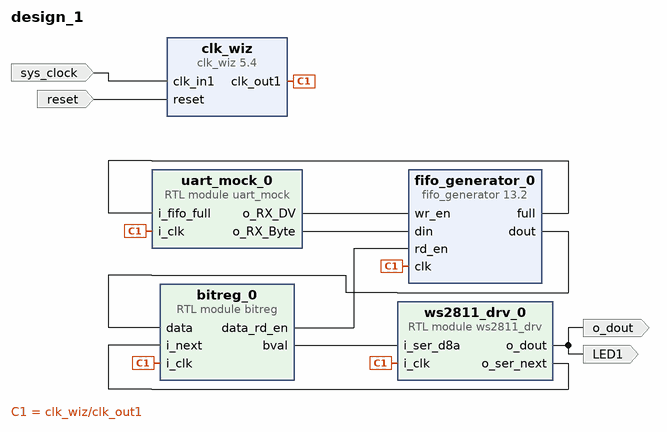
[diagram p0: block diagram of the top level]
# Vivado block design design_1, xc7a35tcpg236-1, Vivado 2017.4
create_bd_design design_1

create_bd_port -dir I -type clk sys_clock
set_property -dict {CONFIG.FREQ_HZ 12000000 CONFIG.PHASE 0.000} [get_bd_ports sys_clock]
create_bd_port -dir O -type data o_dout
create_bd_port -dir O -type data LED1
create_bd_port -dir I -type rst reset
set_property -dict {CONFIG.POLARITY ACTIVE_HIGH} [get_bd_ports reset]

create_bd_cell -type ip -vlnv xilinx.com:ip:clk_wiz:5.4 clk_wiz
set_property -dict [list \
  CONFIG.ENABLE_CLOCK_MONITOR false \
  CONFIG.PRIMITIVE MMCM \
  CONFIG.USE_MIN_POWER true \
  CONFIG.JITTER_SEL No_Jitter \
  CONFIG.CLKOUT1_DRIVES BUFGCE \
  CONFIG.CLKOUT2_DRIVES BUFGCE \
  CONFIG.CLKOUT3_DRIVES BUFGCE \
  CONFIG.CLKOUT4_DRIVES BUFGCE \
  CONFIG.CLKOUT5_DRIVES BUFGCE \
  CONFIG.CLKOUT6_DRIVES BUFGCE \
  CONFIG.CLKOUT7_DRIVES BUFGCE \
  CONFIG.FEEDBACK_SOURCE FDBK_AUTO \
  CONFIG.USE_LOCKED true \
  CONFIG.USE_INCLK_STOPPED false \
  CONFIG.USE_CLKFB_STOPPED false \
  CONFIG.OVERRIDE_MMCM false \
  CONFIG.MMCM_DIVCLK_DIVIDE 1 \
  CONFIG.MMCM_CLKFBOUT_MULT_F 53.125 \
  CONFIG.MMCM_COMPENSATION ZHOLD \
  CONFIG.MMCM_CLKOUT0_DIVIDE_F 6.375 \
  CONFIG.MMCM_CLKOUT0_DUTY_CYCLE 0.5 \
  CONFIG.USE_SAFE_CLOCK_STARTUP true \
  CONFIG.USE_BOARD_FLOW true \
  CONFIG.CLK_IN1_BOARD_INTERFACE sys_clock \
  CONFIG.CLK_IN2_BOARD_INTERFACE Custom \
  CONFIG.RESET_BOARD_INTERFACE reset \
  CONFIG.CLKOUT1_JITTER 544.175 \
  CONFIG.CLKOUT1_PHASE_ERROR 622.384 \
] [get_bd_cells clk_wiz]
create_bd_cell -type ip -vlnv xilinx.com:ip:fifo_generator:13.2 fifo_generator_0
set_property -dict [list \
  CONFIG.INTERFACE_TYPE Native \
  CONFIG.Input_Data_Width 8 \
  CONFIG.Input_Depth 16384 \
  CONFIG.Output_Data_Width 8 \
  CONFIG.Reset_Type Synchronous_Reset \
  CONFIG.Almost_Full_Flag false \
  CONFIG.Valid_Flag false \
  CONFIG.Underflow_Flag true \
  CONFIG.Write_Acknowledge_Flag false \
  CONFIG.Data_Count false \
  CONFIG.FIFO_Implementation_wach Common_Clock_Distributed_RAM \
  CONFIG.FIFO_Implementation_wrch Common_Clock_Distributed_RAM \
  CONFIG.FIFO_Implementation_rach Common_Clock_Distributed_RAM \
] [get_bd_cells fifo_generator_0]
create_bd_cell -type module -reference bitreg bitreg_0
create_bd_cell -type module -reference ws2811_drv ws2811_drv_0
create_bd_cell -type module -reference uart_mock uart_mock_0

# ---- connections ----

connect_bd_net [get_bd_pins clk_wiz/clk_out1] \
  [get_bd_pins fifo_generator_0/clk] [get_bd_pins bitreg_0/i_clk] [get_bd_pins ws2811_drv_0/i_clk] \
  [get_bd_pins uart_mock_0/i_clk]
connect_bd_net [get_bd_ports sys_clock] [get_bd_pins clk_wiz/clk_in1]
connect_bd_net [get_bd_pins ws2811_drv_0/o_dout] [get_bd_ports LED1] [get_bd_ports o_dout]
connect_bd_net [get_bd_pins fifo_generator_0/dout] [get_bd_pins bitreg_0/data]
connect_bd_net [get_bd_pins bitreg_0/data_rd_en] [get_bd_pins fifo_generator_0/rd_en]
connect_bd_net -net ws2811_drv_0_o_ser_re [get_bd_pins ws2811_drv_0/o_ser_next] [get_bd_pins bitreg_0/i_next]
connect_bd_net [get_bd_pins bitreg_0/bval] [get_bd_pins ws2811_drv_0/i_ser_d8a]
connect_bd_net [get_bd_ports reset] [get_bd_pins clk_wiz/reset]
connect_bd_net [get_bd_pins fifo_generator_0/full] [get_bd_pins uart_mock_0/i_fifo_full]
connect_bd_net [get_bd_pins uart_mock_0/o_RX_DV] [get_bd_pins fifo_generator_0/wr_en]
connect_bd_net [get_bd_pins uart_mock_0/o_RX_Byte] [get_bd_pins fifo_generator_0/din]

validate_bd_design
save_bd_design
